# EAGLE design RotaryEncoderBoard (EAGLE 7.5.0)
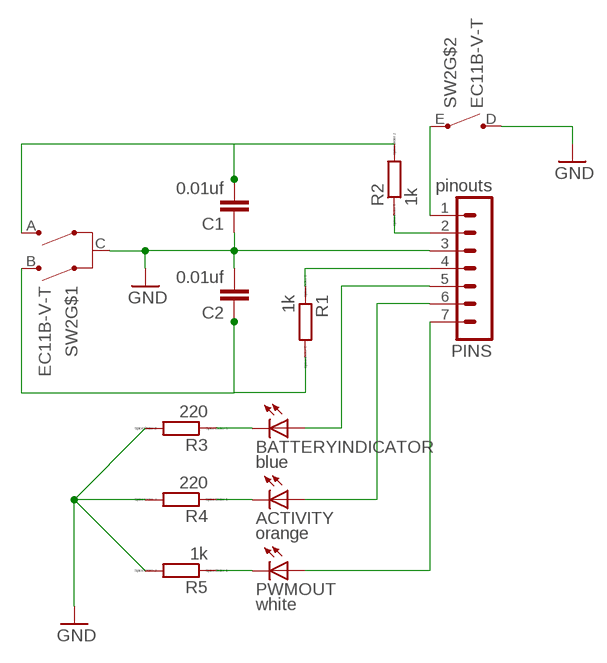
[diagram p0: schematic, sheet 1]

## Parts
ACTIVITY  orange  LED1206  [LED-1206]
BATTERYINDICATOR  blue  LED1206  [LED-1206]
C1  0.01uf  C2,5-3  [C2.5-3]
C2  0.01uf  C2,5-3  [C2.5-3]
PINS  pinouts  MA07-1  [MA07-1]
PWMOUT  white  LED1206  [LED-1206]
R1  1k  R0204/7  [0204/7]
R2  1k  R0204/7  [0204/7]
R3  220  R0204/7  [0204/7]
R4  220  R0204/7  [0204/7]
R5  1k  R0204/7  [0204/7]
SW2  EC11B-V-T  [EC11B-V]

## Nets
GND: C1.1 C2.2 PINS.3 R3.2 R4.2 R5.2 SW2.C SW2.D
N$1: PINS.2 R2.1
N$2: C1.2 R2.2 SW2.A
N$3: C2.1 R1.2 SW2.B
N$4: PINS.4 R1.1
N$5: PINS.7 PWMOUT.A
N$6: ACTIVITY.A PINS.6
N$7: PINS.1 SW2.E
N$8: BATTERYINDICATOR.A PINS.5
N$9: PWMOUT.C R5.1
N$10: ACTIVITY.C R4.1
N$11: BATTERYINDICATOR.C R3.1

## Library data of the parts
ACTIVITY BATTERYINDICATOR PWMOUT = LilyPad-Wearables:LED: LEDs Standard schematic elements and footprints for 5mm, 3mm, 1206, and 0603 sized LEDs. 5mm - Spark Fun Electronics SKU : Comp-SBL
C1 C2 = capacitor-wima:C: CAPACITOR naming: grid - package width
PINS = con-lstb:MA07-1: PIN HEADER; OC_FARNELL: unknown; OC_NEWARK: unknown
R1-R5 = eagle-ltspice:R: RESISTOR, European symbol; SPICEMODEL: NONE; SPICEPREFIX: R
SW2 = alps:EC11B-V-T: ALPS EC11B Vertikal mit Taster Drehimpulsgeber 11mm

## Net classes
0 default: width 1 mm, drill 1 mm, clearance 0.5 mm
1 manualwire: width 1 mm, drill 1 mm, clearance 0.5 mm

## Board
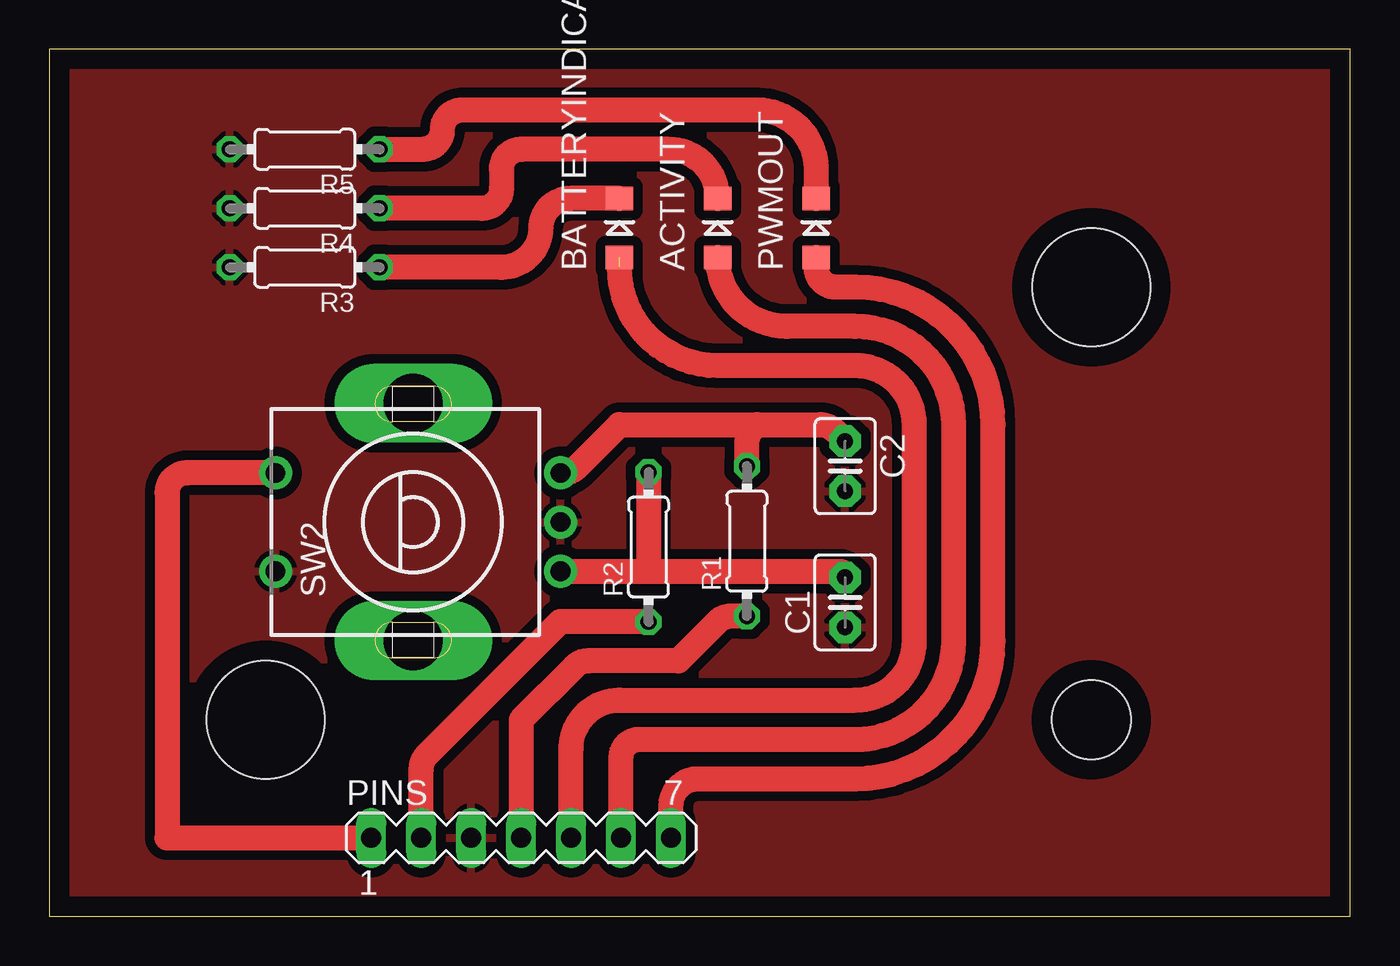
[diagram p1: board, top side]

Size 66.17 x 44.09 mm. Coordinates in mm from the lower left corner, seen from the top.
Outline: 0,0 66.17,0 66.17,44.09 0,44.09 0,0
Copper layers (1*16): Top 0.035mm / dielectric 1.5mm / Bottom 0.035mm
Design rules "default": minimum track width 10mil, minimum drill 24mil, track to track 8mil, track to pad 8mil, pad to pad 8mil, via to via 8mil, smd to smd 8mil, copper to edge 40mil, drill to drill 8mil, minimum pad ring 10mil, minimum via ring 8mil, stop-mask expansion 4mil, vias tented up to drill 0mil, thermal gap 10mil
Holes 4 mm at 53,10
Holes 6 mm at 11,10 53,32

### Footprints (pad centres in the part's own frame; a part is rotated, then mirrored left to right if it is on the bottom)
LED-1206 = smd 1.2 x 1.4: A -1.5,0; C 1.5,0
C2.5-3 = drill 0.813 pad 1.6 octagon: 1 -1.27,0; 2 1.27,0
MA07-1 = drill 1.016 long: 1 -7.62,0; 2 -5.08,0; 3 -2.54,0; 4 0,0; 5 2.54,0; 6 5.08,0; 7 7.62,0
0204/7 = drill 0.813 octagon: 1 -3.81,0; 2 3.81,0
EC11B-V = drill 1 pad 1.676: A -2.5,-7.5; B 2.5,-7.5; C 0,-7.5; D -2.5,7; E 2.5,7 | drill 3 pad 3.3 long: G1 -6.032,0; G2 6.032,0

### Placement (x,y rotation side)
ACTIVITY  34,35 90 top
BATTERYINDICATOR  29,35 90 top
C1  40.48,15.97 90 top
C2  40.48,22.89 270 top
PINS  24,4 0 top
PWMOUT  39,35 90 top
R1  35.48,19.08 90 top
R2  30.48,18.78 90 top
R3  13,33 180 top
R4  13,36 180 top
R5  13,39 180 top
SW2  18.51,20.05 90 top

### Tracks (layer width: path | path; a pad name or v marks a point on that pad's centre or on a via)
GND
  pour Top: -1.27,45.37 -1.27,-1.27 67.77,-1.27 67.77,45.37
N$1
  Top 1.27: PINS.2 18.92,7.51 arc-45 19.21,8.21 26,15 30.41,15 arc-45 R2.1
N$2
  Top 1.27: SW2.A 31,17.55 | 31,17.55 40.17,17.55 arc-90 C1.2 | R2.2 30.48,18.07 arc90 31,17.55
N$3
  Top 1.27: SW2.B 26.14,22.55 arc45 26.84,22.84 29,25 36,25 | 36,25 39.23,25 arc-45 39.93,24.71 C2.1 | R1.2 35.48,24.07 arc-45 35.77,24.77 36,25
N$4
  Top 1.27: R1.1 34.68,15.27 arc45 33.98,14.98 32,13 27.41,13 arc45 26.71,12.71 24,10 PINS.4
N$5
  Top 1.27: PINS.7 31.62,5.62 arc-90 33,7 41,7 arc90 48,14 48,25 arc90 41,32 40,32 arc-90 39,33 PWMOUT.A
N$6
  Top 1.27: PINS.6 29.08,8.08 arc-90 30,9 41,9 arc90 46,14 46,25 arc90 41,30 37.5,30 arc-90 ACTIVITY.A
N$7
  Top 1.27: SW2.E 7,22.55 arc90 6,21.55 6,4 PINS.1
N$8  (1 unrouted)
  Top 1.27: PINS.5 26.54,8.54 arc-90 29,11 41,11 arc90 44,14 44,25 arc90 41,28 34,28 arc-90 29,33
N$9
  Top 1.27: R5.1 19,39 arc90 20,40 arc-90 21,41 36,41 arc-90 39,38 PWMOUT.C
N$10
  Top 1.27: ACTIVITY.C arc90 31.5,39 24,39 arc90 23,38 23,37 arc-90 22,36 R4.1
N$11
  Top 1.27: BATTERYINDICATOR.C 26.5,36.5 arc90 25,35 arc-90 23,33 R3.1